# EAGLE design eurodev (EAGLE 9.6.2)
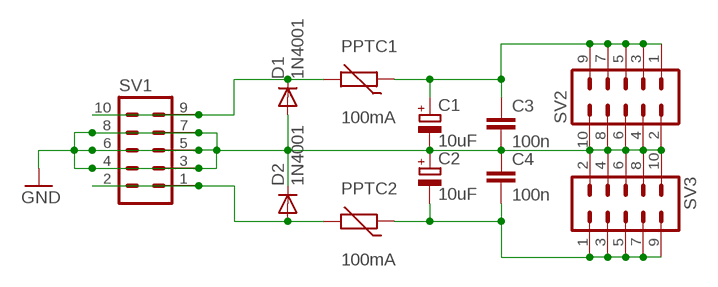
[diagram p0: schematic, sheet 1]

## Parts
C1  10uF  CPOL-EUE2,5-6E  [E2,5-6E]
C2  10uF  CPOL-EUE2,5-6E  [E2,5-6E]
C3  100n  C-EU050-025X075  [C050-025X075]
C4  100n  C-EU050-025X075  [C050-025X075]
D1  1N4001  1N4004  [DO41-10]
D2  1N4001  1N4004  [DO41-10]
PPTC1  100mA  THERMISTOR-5  [R-5]
PPTC2  100mA  THERMISTOR-5  [R-5]
SV1  10_PIN_HEADER  [MA05-2]
SV2  MA05-2  [MA05-2]
SV3  MA05-2  [MA05-2]

## Nets
GND: C1.- C2.+ C3.2 C4.1 D1.A D2.C SV1.3 SV1.4 SV1.5 SV1.6 SV1.7 SV1.8 SV2.2 SV2.4 SV2.6 SV2.8 SV2.10 SV3.2 SV3.4 SV3.6 SV3.8 SV3.10
N$1: C1.+ C3.1 PPTC1.1 SV2.1 SV2.3 SV2.5 SV2.7 SV2.9
N$6: C2.- C4.2 PPTC2.1 SV3.1 SV3.3 SV3.5 SV3.7 SV3.9
N$27: D1.C PPTC1.2 SV1.9 SV1.10
N$30: D2.A PPTC2.2 SV1.1 SV1.2

## Library data of the parts
C1 C2 = rcl:CPOL-EU: POLARIZED CAPACITOR, European symbol; MF: RUBYCON; MPN: 35ZLG10MEFC5X7; OC_FARNELL: 1281818; SPICEPREFIX: C
C3 C4 = rcl:C-EU: CAPACITOR, European symbol; MF: EPCOS; MPN: B32529C0104J289; OC_FARNELL: 2797801; SPICEPREFIX: C
D1 D2 = diode:1N4004: DIODE general purpose rectifier, 1 A; MF: VISHAY; MPN: 1N4001-E3/54; OC_FARNELL: 2889052
PPTC1 PPTC2 = varistor:THERMISTOR: THERMISTOR; MF: LITTELFUSE; MPN: 60R010XU; OC_FARNELL: 1822246
SV1 = TomW:10_PIN_HEADER: PIN HEADER; MF: AMPHENOL ICC; MPN: 67997-410HLF; OC_FARNELL: 2751378; OC_NEWARK: unknown
SV2 SV3 = nagasaki45:MA05-2: PIN HEADER; MF: AMPHENOL ICC; MPN: 67997-410HLF; OC_FARNELL: 2751378; OC_NEWARK: unknown

## Board
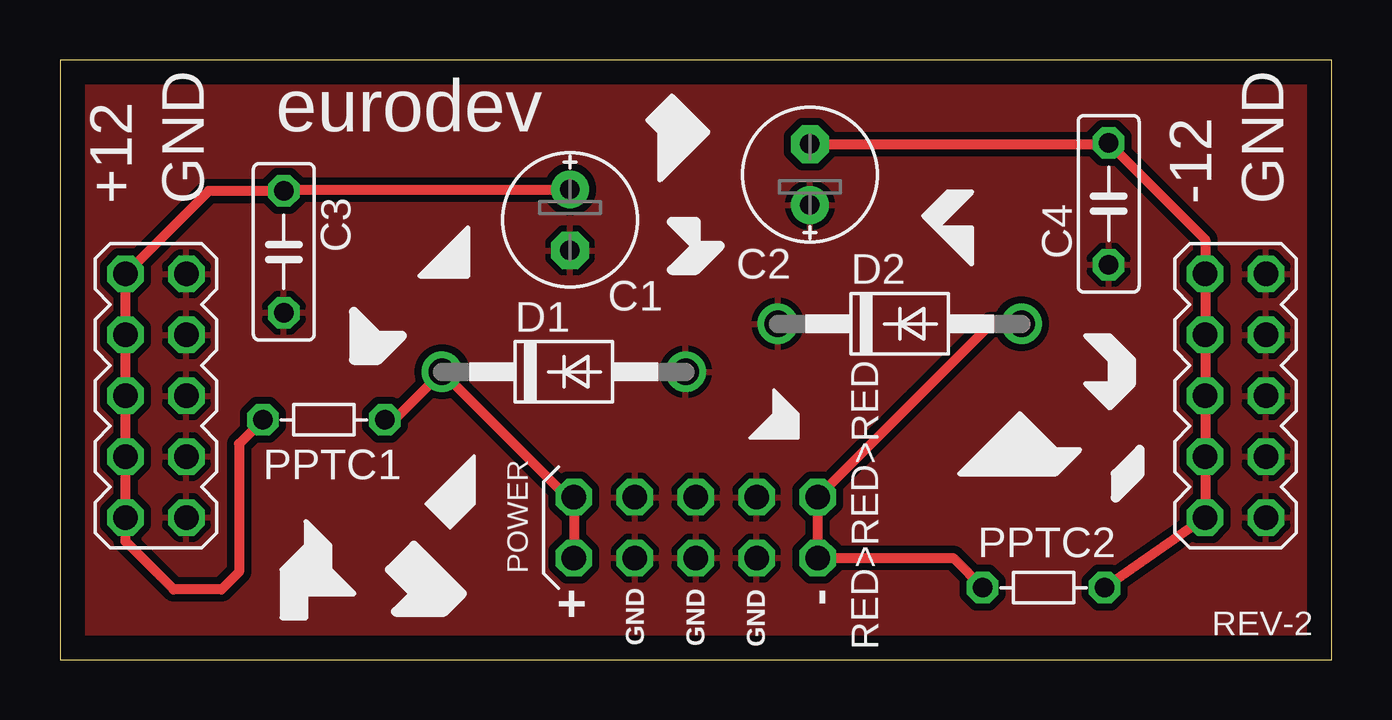
[diagram p1: board, top side]

Size 53 x 25 mm. Coordinates in mm from the lower left corner, seen from the top.
Outline: 0,0 53,0 53,25 0,25 0,0
Copper layers (1*16): Top 0.035mm / dielectric 1.5mm / Bottom 0.035mm
Design rules "default": minimum track width 6mil, minimum drill 0.35mm, track to track 6mil, track to pad 6mil, pad to pad 6mil, via to via 6mil, smd to smd 6mil, copper to edge 40mil, drill to drill 6mil, minimum pad ring 10mil, minimum via ring 8mil, stop-mask expansion 4mil, vias tented up to drill 0mil, thermal gap 10mil

### Footprints (pad centres in the part's own frame; a part is rotated, then mirrored left to right if it is on the bottom)
E2,5-6E = drill 0.813 pad 1.575: + -1.27,0 | drill 0.813 pad 1.575 octagon: - 1.27,0
C050-025X075 = drill 0.813 octagon: 1 -2.54,0; 2 2.54,0
DO41-10 = drill 1.118: A 5.08,0; C -5.08,0
R-5 = drill 0.813 octagon: 1 -2.54,0; 2 2.54,0
MA05-2 = drill 1.016 octagon: 1 -5.08,-1.27; 2 -5.08,1.27; 3 -2.54,-1.27; 4 -2.54,1.27; 5 0,-1.27; 6 0,1.27; 7 2.54,-1.27; 8 2.54,1.27; 9 5.08,-1.27; 10 5.08,1.27

### Placement (x,y rotation side)
C1  21.26,18.33 270 top
C2  31.26,20.22 90 top
C3  9.33,17 270 top
C4  43.71,19 90 top
D1  21,12 0 top
D2  35,14 0 top
PPTC1  11,10 0 top
PPTC2  41,3 180 top
SV1  26.5,5.5 180 top
SV2  4,11 270 top
SV3  49,11 270 top

### Tracks (layer width: path | path; a pad name or v marks a point on that pad's centre or on a via)
GND
  pour Top (isolate 0.305): -1,26 -1,-1 54,-1 54,26
N$1
  Top 0.406: C1.+ 9.35,19.6 C3.1 6.19,19.54 SV2.1 SV2.3 SV2.5 SV2.7 SV2.9 2.73,4.92 4.73,2.92 6.73,2.92 7.46,3.65 7.46,9 PPTC1.1
N$6
  Top 0.406: C2.- 43.7,21.49 C4.2 47.73,17.52 SV3.1 SV3.3 SV3.5 SV3.7 SV3.9 PPTC2.1
N$27
  Top 0.406: SV1.10 SV1.9 21.11,6.81 D1.C 13.92,10 PPTC1.2
N$30
  Top 0.406: D2.A 38.81,14 SV1.1 SV1.2 37.23,4.23 PPTC2.2

### Text on the board
tPlace: eurodev | +12 | GND | -12 | GND | REV-2